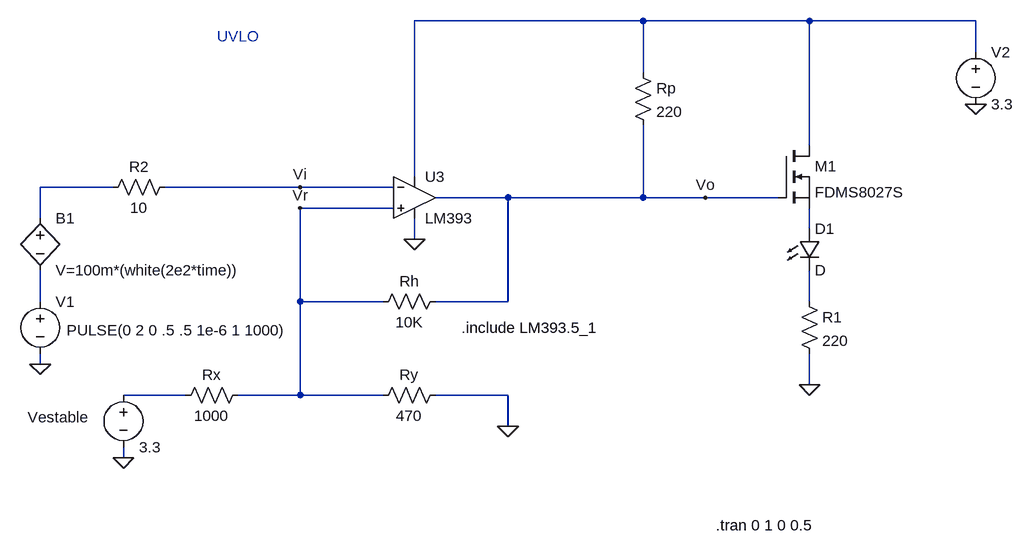
[diagram p0: schematic UVLO.asc]
UVLO.asc, the LTspice schematic file:
Version 4
SHEET 1 1336 1092
WIRE -2384 48 -2736 48
WIRE -2128 48 -2384 48
WIRE -1872 48 -2128 48
WIRE -1872 96 -1872 48
WIRE -2384 128 -2384 48
WIRE -2128 240 -2128 48
WIRE -2736 288 -2736 48
WIRE -3200 304 -3312 304
WIRE -2912 304 -3120 304
WIRE -2768 304 -2912 304
WIRE -2592 320 -2704 320
WIRE -2384 320 -2384 208
WIRE -2384 320 -2592 320
WIRE -2288 320 -2384 320
WIRE -2176 320 -2288 320
WIRE -2768 336 -2912 336
WIRE -3312 352 -3312 304
WIRE -2128 368 -2128 336
WIRE -2736 384 -2736 352
WIRE -3312 480 -3312 432
WIRE -2912 480 -2912 336
WIRE -2784 480 -2912 480
WIRE -2592 480 -2592 320
WIRE -2592 480 -2704 480
WIRE -2128 480 -2128 432
WIRE -3312 576 -3312 560
WIRE -2128 608 -2128 560
WIRE -3088 624 -3184 624
WIRE -2912 624 -2912 480
WIRE -2912 624 -3008 624
WIRE -2784 624 -2912 624
WIRE -2592 624 -2704 624
WIRE -2592 672 -2592 624
WIRE -3184 720 -3184 704
FLAG -1872 176 0
FLAG -3312 576 0
FLAG -2736 384 0
FLAG -3184 720 0
FLAG -2592 672 0
FLAG -2128 608 0
FLAG -2912 304 Vi
FLAG -2288 320 Vo
FLAG -2912 336 Vr
SYMBOL voltage -3312 464 R0
WINDOW 3 41 60 Left 2
WINDOW 123 0 0 Left 0
WINDOW 39 0 0 Left 0
SYMATTR Value PULSE(0 2 0 .5 .5 1e-6 1 1000)
SYMATTR InstName V1
SYMBOL voltage -1872 80 R0
WINDOW 123 0 0 Left 0
WINDOW 39 0 0 Left 0
SYMATTR InstName V2
SYMATTR Value 3.3
SYMBOL res -2400 112 R0
SYMATTR InstName Rp
SYMATTR Value 220
SYMBOL voltage -3184 608 R0
WINDOW 0 -147 50 Left 2
SYMATTR InstName Vestable
SYMATTR Value 3.3
SYMBOL res -2992 608 R90
WINDOW 0 0 56 VBottom 2
WINDOW 3 32 56 VTop 2
SYMATTR InstName Rx
SYMATTR Value 1000
SYMBOL res -2688 608 R90
WINDOW 0 0 56 VBottom 2
WINDOW 3 32 56 VTop 2
SYMATTR InstName Ry
SYMATTR Value 470
SYMBOL res -2688 464 R90
WINDOW 0 0 56 VBottom 2
WINDOW 3 32 56 VTop 2
SYMATTR InstName Rh
SYMATTR Value 10K
SYMBOL res -2144 464 R0
SYMATTR InstName R1
SYMATTR Value 220
SYMBOL nmos -2176 240 R0
SYMATTR InstName M1
SYMATTR Value FDMS8027S
SYMBOL res -3104 288 R90
WINDOW 0 0 56 VBottom 2
WINDOW 3 32 56 VTop 2
SYMATTR InstName R2
SYMATTR Value 10
SYMBOL bv -3312 336 R0
SYMATTR InstName B1
SYMATTR Value V=100m*(white(2e2*time))
SYMBOL LED -2144 368 R0
SYMATTR InstName D1
SYMBOL OpAmps\\opamp2 -2736 256 R0
SYMATTR InstName U3
SYMATTR Value LM393
TEXT -2272 824 Left 2 !.tran 0 1 0 0.5
TEXT -3040 72 Left 2 ;UVLO
TEXT -2664 520 Left 2 !.include LM393.5_1

The netlist it stands for:
* UVLO.asc
V1 N004 0 PULSE(0 2 0 .5 .5 1e-6 1 1000)
V2 N001 0 3.3
Rp N001 Vo 220
Vestable N006 0 3.3
Rx Vr N006 1000
Ry 0 Vr 470
Rh Vo Vr 10K
R1 N005 0 220
M1 N001 Vo N003 N003 FDMS8027S
R2 Vi N002 10
B1 N002 N004 V=100m*(white(2e2*time))
D1 N003 N005 D
XU3 Vr Vi N001 0 Vo LM393  ; pins In+ In- V+ V- OUT
.model D D
.lib standard.dio
.model NMOS NMOS
.model PMOS PMOS
.lib standard.mos
.tran 0 1 0 0.5
* UVLO
.include LM393.5_1
.backanno
.end